# Altium project Chicker.PrjPcb
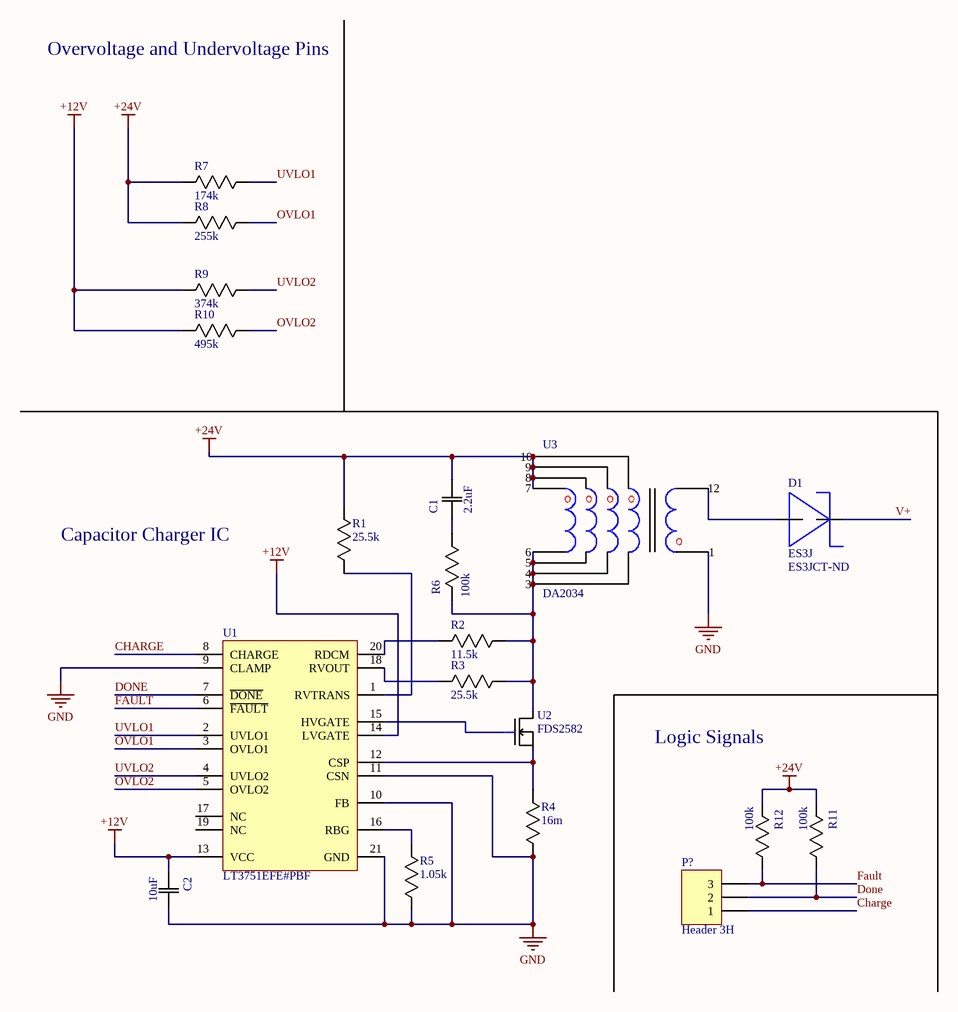
[diagram p0: Chicker.SchDoc]
1 sheet, 19 parts. Net scope: global (net labels, ports and power ports of the same name join across sheets).
Board file: Chicker.PcbDoc

## Sheet Chicker.SchDoc
size A4

### Parts
C1  2.2uF  [0805]
C2  10uF  [0805]
D1  ES3J  Supplier Part Number 1: ES3JCT-ND  [D0214-AB]
P?  Header 3H  [HDR1X3H]
R1  25.5k  [0805]
R2  11.5k  [0805]
R3  25.5k  [0805]
R4  16m  [0805]
R5  1.05k  [0805]
R6  100k  [0805]
R7  174k  [0805]
R8  255k  [0805]
R9  374k  [0805]
R10  495k  [0805]
R11  100k  [0805]
R12  100k  [0805]
U1  LT3751EFE#PBF  [LT-FE-20-EPV-CB_L]
U2  FDS2582  [8-SOIC MOSFET]
U3  DA2034  [DA2034]

### Nets
+12V: C2.1(C1) R9.2(R2) R10.2(R2) U1.13(VCC) U1.14(LVGATE)
+24V: C1.2(C2) R1.1(R1) R7.2(R2) R8.2(R2) R11.2(R2) R12.2(R2) U3.7 U3.8 U3.9 U3.10
GND: C2.2(C2) R4.2(R2) R5.2(R2) U1.9(CLAMP) U1.10(FB) U1.11(CSN) U1.21(GND) U3.1
CHARGE: P?.1 U1.8(CHARGE)
DONE: P?.2 R11.1(R1) U1.7(~{DONE})
FAULT: P?.3 R12.1(R1) U1.6(~{FAULT})
OVLO1: R8.1(R1) U1.3(OVLO1)
OVLO2: R10.1(R1) U1.5(OVLO2)
UVLO1: R7.1(R1) U1.2(UVLO1)
UVLO2: R9.1(R1) U1.4(UVLO2)
V+: D1.OUT
NetC1_1: C1.1(C1) R6.1(R1)
NetD1_IN: D1.IN U3.12
NetR1_2: R1.2(R2) U1.1(RVTRANS)
NetR2_1: R2.1(R1) R3.1(R1) R6.2(R2) U2.D U3.3 U3.4 U3.5 U3.6
NetR2_2: R2.2(R2) U1.20(RDCM)
NetR3_2: R3.2(R2) U1.18(RVOUT)
NetR4_1: R4.1(R1) U1.12(CSP) U2.S
NetR5_1: R5.1(R1) U1.16(RBG)
NetU1_15: U1.15(HVGATE) U2.G

Not connected (* = marked no-connect by the designer): U1 17(NC) 19(NC)

### Notes on the sheet
- Overvoltage and Undervoltage Pins
- Capacitor Charger IC
- Logic Signals

### Library data of the parts
C1 = CAP 2.2uF 0805: CAP CER 1UF 50V X7R 0805; MP: C0805C225K4RACTU; MF: KEMET; Tolerance: 10%; Rating: 16V; Package: 0805; Price: 0,461 CAD; Value: 2.2uF; Digikey: 399-3523-1-ND; Digikey Link: https://www.digikey.ca/products/en?keywords=399-3523-1-ND
C2 = CAP 10uF 0805: CAP CER 10UF 10V X5R 0805; MP: C0805C106K8PACTU; MF: KEMET; Tolerance: 10%; Package: 0805; Price: 0.168 CAD; Value: 10uF; Digikey: 399-4925-1-ND; Digikey Link: https://www.digikey.ca/product-detail/en/kemet/C0805C106K8PACTU/399-4925-1-ND/1090920; Rating: 10V
D1 = ES3J: Diode Switching 600V 3A 2-Pin DO-214AB T/R; Manufacturer: ON Semiconductor / Fairchild; Element Configuration: Single; Power Dissipation: 1.66W; Reverse Recovery Time: 35ns; Peak Non-Repetitive Surge Current: 100A; Polarity: Standard; Capacitance: 45pF; Forward Voltage: 1.7V; Peak Reverse Current: 10uA; Supplier 1: Digi-Key; Manufacturer Part Number: ES3J; RoHS: Yes; Category: Zener Diodes; Stock 1: 20740; Pricing 1: 1=0.47000, 10=0.37800, 25=0.34600, 100=0.21740, 250=0.21492, 500=0.20126, 1000=0.13685 (USD); Mount: Surface Mount; Case/Package: SMC; Number of Pins: 2; Contact Plating: Tin,Matte; Min Operating Temperature: -50°C; Max Operating Temperature: 150°C; Reverse Voltage: 600V; Max Reverse Voltage (DC): 600V; Average Rectified Current: 3A; Max Repetitive Reverse Voltage (Vrrm): 600V; Max Forward Surge Current (Ifsm): 100A; Current: 3A; Voltage: 600V; Voltage Rating (DC): 600V; Current Rating: 3A; Output Current: 3A; Max Surge Current: 100A; Packaging: Tape and Reel; Package Quantity: 3000; Recovery Time: 35ns; Forward Current: 3A; Length: 7.11mm; Height: 2.616mm; Width: 6.223mm; Radiation Hardening: No; REACH SVHC: No SVHC; Lead Free: Lead Free; ComponentLink1URL: https://datasheet.ciiva.com/4452/es3j-187547-4452440.pdf?src-supplier=Mouser; ComponentLink1Description: https://datasheet.ciiva.com/4452/es3j-187547-4452440.pdf?src-supplier=Mouser; ComponentLink2URL: https://datasheet.ciiva.com/30479/0900766b810e1d0b-30479500.pdf?src-supplier=RSComponents; ComponentLink2Description: https://datasheet.ciiva.com/30479/0900766b810e1d0b-30479500.pdf?src-supplier=RSComponents; ComponentLink3URL: https://datasheet.ciiva.com/22651/1856389-22651960.pdf?src-supplier=Element14; ComponentLink3Description: https://datasheet.ciiva.com/22651/1856389-22651960.pdf?src-supplier=Element14; ComponentLink4URL: https://datasheet.ciiva.com/26230/es3j-26230952.pdf?src-supplier=Avnet+Europe; ComponentLink4Description: https://datasheet.ciiva.com/26230/es3j-26230952.pdf?src-supplier=Avnet+Europe; ComponentLink5URL: https://datasheet.ciiva.com/911/es3a-911003.pdf?src-supplier=Digi-Key; ComponentLink5Description: https://datasheet.ciiva.com/911/es3a-911003.pdf?src-supplier=Digi-Key; ComponentLink6URL: https://datasheet.ciiva.com/911/es3a-911004.pdf?src-supplier=Digi-Key; ComponentLink6Description: https://datasheet.ciiva.com/911/es3a-911004.pdf?src-supplier=Digi-Key; ComponentLink7URL: https://datasheet.ciiva.com/23683/1856389-23683564.pdf?src-supplier=Newark; ComponentLink7Description: https://datasheet.ciiva.com/23683/1856389-23683564.pdf?src-supplier=Newark; ComponentLink8URL: https://datasheet.ciiva.com/17194/es3j-17194703.pdf?src-supplier=Future+Electronics; ComponentLink8Description: https://datasheet.ciiva.com/17194/es3j-17194703.pdf?src-supplier=Future+Electronics; ComponentLink9URL: https://datasheet.ciiva.com/7965/1856389-7965165.pdf?src-supplier=Element14; ComponentLink9Description: https://datasheet.ciiva.com/7965/1856389-7965165.pdf?src-supplier=Element14; ComponentLink10URL: https://datasheet.ciiva.com/8300/es3j-8300861.pdf?src-supplier=Avnet; ComponentLink10Description: https://datasheet.ciiva.com/8300/es3j-8300861.pdf?src-supplier=Avnet
P? = Header 3H: Header, 3-Pin, Right Angle; LatestRevisionDate: 17-Jul-2002; LatestRevisionNote: Re-released for DXP Platform.; Publisher: Altium Limited
R1 R3 = RES 25.5k 0805: 0805 Resistor, 6A, 0.125W, 25ppm, 0.1%, 25K5; Manufacturer: Panasonic; Manufacturer Part Number: ERA-6AEB2552V; Temperature Coefficient: 25ppm/°C; Max Power Dissipation: 125mW; Resistance: 25.5kR; Voltage Rating: 100V; Supplier 1: Digi-Key; RoHS: Yes; Category: Chip SMD Resistors; Stock 1: 5872; Pricing 1: 1=0.36000, 10=0.30200, 100=0.11820, 1000=0.04948, 2500=0.04536 (USD); Mount: Surface Mount; Case/Package: 0805; Number of Pins: 2; Case Code (Imperial): 0805; Case Code (Metric): 2012; Contact Plating: Tin; Min Operating Temperature: -55°C; Max Operating Temperature: 155°C; Number of Terminations: 2; Features: Automotive AEC-Q200; Tolerance: 0.1%; Composition: Metal Film,Thin Film; Packaging: Tape and Reel; Military Standard: Not; Termination: Solder; Power Rating: 125mW; Package Quantity: 1; Voltage Rating (DC): 100V; Length: 2mm; Height: 0.5mm; Width: 1.25mm; Depth: 1.25mm; Radiation Hardening: No; Lead Free: Lead Free; ComponentLink1URL: https://datasheet.ciiva.com/11810/0900766b80eb1d8c-11810651.pdf?src-supplier=RSComponents; ComponentLink1Description: https://datasheet.ciiva.com/11810/0900766b80eb1d8c-11810651.pdf?src-supplier=RSComponents; ComponentLink2URL: https://datasheet.ciiva.com/26335/459526-da-01-en-widerstand-0805-era-26335831.pdf?src-supplier=Conrad; ComponentLink2Description: https://datasheet.ciiva.com/26335/459526-da-01-en-widerstand-0805-era-26335831.pdf?src-supplier=Conrad; ComponentLink3URL: https://datasheet.ciiva.com/7870/485442-7870651.pdf?src-supplier=Element14; ComponentLink3Description: https://datasheet.ciiva.com/7870/485442-7870651.pdf?src-supplier=Element14; ComponentLink4URL: https://datasheet.ciiva.com/5987/485442-5987308.pdf?src-supplier=Farnell; ComponentLink4Description: https://datasheet.ciiva.com/5987/485442-5987308.pdf?src-supplier=Farnell; ComponentLink5URL: https://datasheet.ciiva.com/7870/485442-7870652.pdf?src-supplier=Element14; ComponentLink5Description: https://datasheet.ciiva.com/7870/485442-7870652.pdf?src-supplier=Element14; ComponentLink6URL: https://datasheet.ciiva.com/30151/54aoa0000ce26-30151583.pdf?src-supplier=Onlinecomponents.com; ComponentLink6Description: https://datasheet.ciiva.com/30151/54aoa0000ce26-30151583.pdf?src-supplier=Onlinecomponents.com; ComponentLink7URL: https://datasheet.ciiva.com/9191/aoa0000ce26-9191422.pdf?src-supplier=Avnet; ComponentLink7Description: https://datasheet.ciiva.com/9191/aoa0000ce26-9191422.pdf?src-supplier=Avnet; Supplier Part Number 1: P25.5KDACT-ND
R2 = RES 11.5k 0805: Res Thin Film 0805 11.5K Ohm 0.1% 1/8W 25ppm/C Molded SMD SMD Punched Carrier T/R; Manufacturer: Panasonic; Manufacturer Part Number: ERA-6AEB1152V; Power Rating: 125mW; Resistance: 11.5kR; Voltage Rating: 100V; Temperature Coefficient: 25ppm/°C; Supplier 1: Digi-Key; RoHS: Yes; Category: Chip SMD Resistors; Stock 1: 10661; Pricing 1: 1=0.34000, 10=0.28800, 100=0.11260, 1000=0.04712, 2500=0.04320 (USD); Mount: Surface Mount; Case/Package: 0805; Number of Pins: 2; Case Code (Metric): 2012; Case Code (Imperial): 0805; Contact Plating: Tin; Min Operating Temperature: -55°C; Max Operating Temperature: 155°C; Tolerance: 0.1%; Packaging: Tape and Reel; Max Power Dissipation: 125mW; Composition: Thin Film,Metal Film; Number of Terminations: 2; Voltage Rating (DC): 100V; Termination: Solder; Military Standard: Not; Package Quantity: 1; Features: Automotive AEC-Q200; Length: 2mm; Height: 0.5mm; Width: 1.25mm; Depth: 1.25mm; Radiation Hardening: No; Lead Free: Lead Free; ComponentLink1URL: https://datasheet.ciiva.com/11810/0900766b80eb1d8c-11810868.pdf?src-supplier=RSComponents; ComponentLink1Description: https://datasheet.ciiva.com/11810/0900766b80eb1d8c-11810868.pdf?src-supplier=RSComponents; ComponentLink2URL: https://datasheet.ciiva.com/41450/001181306-da-01-en-widerstand-era-0805-11k5-0-1-5000st-41450464.pdf?src-supplier=Conrad; ComponentLink2Description: https://datasheet.ciiva.com/41450/001181306-da-01-en-widerstand-era-0805-11k5-0-1-5000st-41450464.pdf?src-supplier=Conrad; ComponentLink3URL: https://datasheet.ciiva.com/5987/485442-5987301.pdf?src-supplier=Farnell; ComponentLink3Description: https://datasheet.ciiva.com/5987/485442-5987301.pdf?src-supplier=Farnell; ComponentLink4URL: https://datasheet.ciiva.com/7829/485442-7829142.pdf?src-supplier=Element14; ComponentLink4Description: https://datasheet.ciiva.com/7829/485442-7829142.pdf?src-supplier=Element14; ComponentLink5URL: https://datasheet.ciiva.com/17211/aoa0000ce26-17211855.pdf?src-supplier=Avnet+Europe; ComponentLink5Description: https://datasheet.ciiva.com/17211/aoa0000ce26-17211855.pdf?src-supplier=Avnet+Europe; ComponentLink6URL: https://datasheet.ciiva.com/7829/485442-7829143.pdf?src-supplier=Element14; ComponentLink6Description: https://datasheet.ciiva.com/7829/485442-7829143.pdf?src-supplier=Element14; ComponentLink7URL: https://datasheet.ciiva.com/9193/aoa0000ce26-9193735.pdf?src-supplier=Avnet; ComponentLink7Description: https://datasheet.ciiva.com/9193/aoa0000ce26-9193735.pdf?src-supplier=Avnet; ComponentLink8URL: https://datasheet.ciiva.com/24024/aoa0000ce26-197354-24024328.pdf?src-supplier=Mouser; ComponentLink8Description: https://datasheet.ciiva.com/24024/aoa0000ce26-197354-24024328.pdf?src-supplier=Mouser; Supplier Part Number 1: P11.5KDACT-ND
R4 = RES 16mOhm 0805: Res Thick Film 0805 0.016 Ohm 1% 0.5W(1/2W) ±200ppm/C Molded SMD Automotive Punched T/R; Manufacturer: Panasonic; Manufacturer Part Number: ERJ-6BWFR016V; Resistance: 16mR; Power Rating: 500mW; Temperature Coefficient: 200ppm/°C; Supplier 1: Digi-Key; RoHS: Yes; Category: Chip SMD Resistors; Stock 1: 4585; Pricing 1: 1=0.65000, 10=0.53800, 100=0.36140, 1000=0.21148, 2500=0.20917 (USD); Mount: Surface Mount; Case/Package: 0805; Number of Pins: 2; Contact Plating: Tin; Case Code (Metric): 2012; Case Code (Imperial): 0805; Min Operating Temperature: -55°C; Max Operating Temperature: 155°C; Tolerance: 1%; Packaging: Tape and Reel; Package Quantity: 1; Features: Automotive AEC-Q200; Max Power Dissipation: 500mW; Composition: Thick Film; Number of Terminations: 2; Termination: SMD/SMT; Military Standard: Not; Length: 2mm; Height: 0.028inch; Width: 0.049inch; Depth: 1.25mm; Radiation Hardening: No; Lead Free: Lead Free; ComponentLink1URL: https://datasheet.ciiva.com/11808/0900766b8126441d-11808690.pdf?src-supplier=RSComponents; ComponentLink1Description: https://datasheet.ciiva.com/11808/0900766b8126441d-11808690.pdf?src-supplier=RSComponents; ComponentLink2URL: https://datasheet.ciiva.com/2452/aoa0000ce3-2452594.pdf?src-supplier=Digi-Key; ComponentLink2Description: https://datasheet.ciiva.com/2452/aoa0000ce3-2452594.pdf?src-supplier=Digi-Key; ComponentLink3URL: https://datasheet.ciiva.com/2452/aoa0000ce3-2452592.pdf?src-supplier=Digi-Key; ComponentLink3Description: https://datasheet.ciiva.com/2452/aoa0000ce3-2452592.pdf?src-supplier=Digi-Key; ComponentLink4URL: https://datasheet.ciiva.com/2452/aoa0000ce3-2452593.pdf?src-supplier=Digi-Key; ComponentLink4Description: https://datasheet.ciiva.com/2452/aoa0000ce3-2452593.pdf?src-supplier=Digi-Key; ComponentLink5URL: https://datasheet.ciiva.com/9192/aoa0000ce3-9192761.pdf?src-supplier=Avnet; ComponentLink5Description: https://datasheet.ciiva.com/9192/aoa0000ce3-9192761.pdf?src-supplier=Avnet; ComponentLink6URL: https://datasheet.ciiva.com/17211/aoa0000ce3-17211370.pdf?src-supplier=Avnet+Europe; ComponentLink6Description: https://datasheet.ciiva.com/17211/aoa0000ce3-17211370.pdf?src-supplier=Avnet+Europe; Supplier Part Number 1: P.016AQCT-ND
R5 = RES 1.05k 0805: Res Thin Film 0805 10.5K Ohm 0.1% 0.125W(1/8W) ±25ppm/C Molded SMD Automotive Punched T/R; Manufacturer: Panasonic; Manufacturer Part Number: ERA-6AEB1052V; Resistance: 10.5kR; Power Rating: 125mW; Voltage Rating: 100V; Temperature Coefficient: 25ppm/°C; Supplier 1: Digi-Key; RoHS: Yes; Category: Chip SMD Resistors; Stock 1: 21208; Pricing 1: 1=0.34000, 10=0.28800, 100=0.11260, 1000=0.04712, 2500=0.04320 (USD); Mount: Surface Mount; Case/Package: 0805; Number of Pins: 2; Case Code (Metric): 2012; Case Code (Imperial): 0805; Contact Plating: Tin; Min Operating Temperature: -55°C; Max Operating Temperature: 155°C; Tolerance: 0.1%; Packaging: Tape and Reel; Composition: Thin Film,Metal Film; Package Quantity: 1; Max Power Dissipation: 125mW; Number of Terminations: 2; Termination: Solder; Voltage Rating (DC): 100V; Features: Automotive AEC-Q200; Military Standard: Not; Length: 2mm; Height: 0.5mm; Width: 1.25mm; Depth: 1.25mm; Radiation Hardening: No; Lead Free: Lead Free; REACH SVHC: No SVHC; ComponentLink1URL: https://datasheet.ciiva.com/11810/0900766b80eb1d8c-11810443.pdf?src-supplier=RSComponents; ComponentLink1Description: https://datasheet.ciiva.com/11810/0900766b80eb1d8c-11810443.pdf?src-supplier=RSComponents; ComponentLink2URL: https://datasheet.ciiva.com/41450/001181303-da-01-en-widerstand-era-0805-10k5-0-1-5000st-41450463.pdf?src-supplier=Conrad; ComponentLink2Description: https://datasheet.ciiva.com/41450/001181303-da-01-en-widerstand-era-0805-10k5-0-1-5000st-41450463.pdf?src-supplier=Conrad; ComponentLink3URL: https://datasheet.ciiva.com/5987/485442-5987261.pdf?src-supplier=Farnell; ComponentLink3Description: https://datasheet.ciiva.com/5987/485442-5987261.pdf?src-supplier=Farnell; ComponentLink4URL: https://datasheet.ciiva.com/17211/aoa0000ce26-17211965.pdf?src-supplier=Avnet+Europe; ComponentLink4Description: https://datasheet.ciiva.com/17211/aoa0000ce26-17211965.pdf?src-supplier=Avnet+Europe; ComponentLink5URL: https://datasheet.ciiva.com/9194/aoa0000ce26-9194028.pdf?src-supplier=Avnet; ComponentLink5Description: https://datasheet.ciiva.com/9194/aoa0000ce26-9194028.pdf?src-supplier=Avnet; ComponentLink6URL: https://datasheet.ciiva.com/5987/485442-5987263.pdf?src-supplier=Farnell; ComponentLink6Description: https://datasheet.ciiva.com/5987/485442-5987263.pdf?src-supplier=Farnell; Supplier Part Number 1: P10.5KDACT-ND
R6 R11 R12 = RES 100k 0805: RES SMD 100K OHM 1% 1/8W 0805; MP: RC0805FR-07100KL; MF: Yageo; Rating: 0.125W; Digikey: 311-100KCRCT-ND; Price: 0.058 CAD; Package: 0805; Value: 100k; Digikey Link: https://www.digikey.ca/products/en?keywords=311-100KCRCT-ND; Tolerance: 1%
R7 = RES 174k 0805: RES SMD 174K OHM 1% 1/8W 0805; Manufacturer: Yageo; Manufacturer Part Number: RC0805FR-07174KL; Max Power Dissipation: 125mW; Resistance: 174kR; Temperature Coefficient: 100ppm/°C; Voltage Rating: 150V; Supplier 1: Digi-Key; RoHS: Yes; Category: Chip SMD Resistors; Stock 1: 27863; Pricing 1: 1=0.10000, 10=0.04000, 100=0.01630, 1000=0.00731, 2500=0.00635 (USD); Case/Package: 0805; Case Code (Metric): 2012; Case Code (Imperial): 0805; Contact Plating: Tin,Matte; Min Operating Temperature: -55°C; Max Operating Temperature: 155°C; Package Quantity: 1; Power Rating: 125mW; Tolerance: 1%; Packaging: Tape and Reel; Features: Moisture Resistant; Composition: Thick Film; Number of Terminations: 2; Termination: SMD/SMT; Military Standard: Not; Voltage Rating (DC): 150V; Length: 2mm; Height: 0.024inch; Width: 0.049inch; Depth: 1.25mm; Radiation Hardening: No; Lead Free: Lead Free; ComponentLink1URL: https://datasheet.ciiva.com/2509/pyu-r-int-thick-7-2509472.pdf?src-supplier=Digi-Key; ComponentLink1Description: https://datasheet.ciiva.com/2509/pyu-r-int-thick-7-2509472.pdf?src-supplier=Digi-Key; ComponentLink2URL: https://datasheet.ciiva.com/2509/pyu-r-int-thick-7-2509471.pdf?src-supplier=Digi-Key; ComponentLink2Description: https://datasheet.ciiva.com/2509/pyu-r-int-thick-7-2509471.pdf?src-supplier=Digi-Key; ComponentLink3URL: https://datasheet.ciiva.com/2509/pyu-r-int-thick-7-2509473.pdf?src-supplier=Digi-Key; ComponentLink3Description: https://datasheet.ciiva.com/2509/pyu-r-int-thick-7-2509473.pdf?src-supplier=Digi-Key; Supplier Part Number 1: 311-174KCRCT-ND
R8 = RES 255k 0805: 0805 Resistor, 6A, 0.125W, 25ppm, 0.1%, 255K; Manufacturer: Panasonic; Manufacturer Part Number: ERA-6AEB2553V; Max Power Dissipation: 125mW; Resistance: 255kR; Temperature Coefficient: 25ppm/°C; Voltage Rating (DC): 100V; Voltage Rating: 200V; Supplier 1: Digi-Key; RoHS: Yes; Category: Chip SMD Resistors; Stock 1: 7869; Pricing 1: 1=0.36000, 10=0.30200, 100=0.11820, 1000=0.04948, 2500=0.04536 (USD); Mount: Surface Mount; Case/Package: 0805; Number of Pins: 2; Weight: 0.000194oz; Case Code (Imperial): 0805; Case Code (Metric): 2012; Contact Plating: Tin; Min Operating Temperature: -55°C; Max Operating Temperature: 155°C; Features: Automotive AEC-Q200; Tolerance: 0.1%; Number of Terminations: 2; Packaging: Tape and Reel; Composition: Metal Film,Thin Film; Power Rating: 125mW; Termination: SMD/SMT; Military Standard: Not; Package Quantity: 1; Length: 2mm; Height: 0.5mm; Width: 1.25mm; Depth: 1.25mm; Radiation Hardening: No; Lead Free: Lead Free; REACH SVHC: No SVHC; ComponentLink1URL: https://datasheet.ciiva.com/11810/0900766b80eb1d8c-11810615.pdf?src-supplier=RSComponents; ComponentLink1Description: https://datasheet.ciiva.com/11810/0900766b80eb1d8c-11810615.pdf?src-supplier=RSComponents; ComponentLink2URL: https://datasheet.ciiva.com/41450/001181380-da-01-en-widerstand-era-0805-255k-0-1-5000st-41450539.pdf?src-supplier=Conrad; ComponentLink2Description: https://datasheet.ciiva.com/41450/001181380-da-01-en-widerstand-era-0805-255k-0-1-5000st-41450539.pdf?src-supplier=Conrad; ComponentLink3URL: https://datasheet.ciiva.com/5981/485442-5981317.pdf?src-supplier=Farnell; ComponentLink3Description: https://datasheet.ciiva.com/5981/485442-5981317.pdf?src-supplier=Farnell; ComponentLink4URL: https://datasheet.ciiva.com/5981/485442-5981318.pdf?src-supplier=Farnell; ComponentLink4Description: https://datasheet.ciiva.com/5981/485442-5981318.pdf?src-supplier=Farnell; ComponentLink5URL: https://datasheet.ciiva.com/5981/485442-5981319.pdf?src-supplier=Farnell; ComponentLink5Description: https://datasheet.ciiva.com/5981/485442-5981319.pdf?src-supplier=Farnell; ComponentLink6URL: https://datasheet.ciiva.com/5981/485442-5981320.pdf?src-supplier=Farnell; ComponentLink6Description: https://datasheet.ciiva.com/5981/485442-5981320.pdf?src-supplier=Farnell; ComponentLink7URL: https://datasheet.ciiva.com/17206/aoa0000ce26-17206655.pdf?src-supplier=Avnet+Europe; ComponentLink7Description: https://datasheet.ciiva.com/17206/aoa0000ce26-17206655.pdf?src-supplier=Avnet+Europe; Supplier Part Number 1: P255KDACT-ND
R9 = RES 374k 0805: 0805 Resistor, 6A, 0.125W, 25ppm, 0.1%, 374K; Manufacturer: Panasonic; Manufacturer Part Number: ERA-6AEB3743V; Resistance: 374kR; Temperature Coefficient: 25ppm/°C; Max Power Dissipation: 125mW; Voltage Rating: 100V; Supplier 1: Digi-Key; RoHS: Yes; Category: Chip SMD Resistors; Stock 1: 10062; Pricing 1: 1=0.34000, 10=0.28800, 100=0.11260, 1000=0.04712, 2500=0.04320 (USD); Mount: Surface Mount; Case/Package: 0805; Number of Pins: 2; Contact Plating: Tin; Case Code (Metric): 2012; Case Code (Imperial): 0805; Min Operating Temperature: -55°C; Max Operating Temperature: 155°C; Tolerance: 0.1%; Packaging: Tape and Reel; Package Quantity: 5000; Features: Automotive AEC-Q200; Number of Terminations: 2; Composition: Thin Film,Metal Film; Power Rating: 125mW; Termination: Solder; Voltage Rating (DC): 100V; Length: 2mm; Height: 0.5mm; Width: 1.25mm; Depth: 1.25mm; Radiation Hardening: No; Lead Free: Lead Free; ComponentLink1URL: https://datasheet.ciiva.com/11810/0900766b80eb1d8c-11810612.pdf?src-supplier=RSComponents; ComponentLink1Description: https://datasheet.ciiva.com/11810/0900766b80eb1d8c-11810612.pdf?src-supplier=RSComponents; ComponentLink2URL: https://datasheet.ciiva.com/41450/001181392-da-01-en-widerstand-era-0805-374k-0-1-5000st-41450550.pdf?src-supplier=Conrad; ComponentLink2Description: https://datasheet.ciiva.com/41450/001181392-da-01-en-widerstand-era-0805-374k-0-1-5000st-41450550.pdf?src-supplier=Conrad; ComponentLink3URL: https://datasheet.ciiva.com/17206/aoa0000ce26-17206008.pdf?src-supplier=Avnet+Europe; ComponentLink3Description: https://datasheet.ciiva.com/17206/aoa0000ce26-17206008.pdf?src-supplier=Avnet+Europe; ComponentLink4URL: https://datasheet.ciiva.com/6001/485442-6001717.pdf?src-supplier=Farnell; ComponentLink4Description: https://datasheet.ciiva.com/6001/485442-6001717.pdf?src-supplier=Farnell; ComponentLink5URL: https://datasheet.ciiva.com/9182/aoa0000ce26-9182549.pdf?src-supplier=Avnet; ComponentLink5Description: https://datasheet.ciiva.com/9182/aoa0000ce26-9182549.pdf?src-supplier=Avnet; ComponentLink6URL: https://datasheet.ciiva.com/6001/485442-6001718.pdf?src-supplier=Farnell; ComponentLink6Description: https://datasheet.ciiva.com/6001/485442-6001718.pdf?src-supplier=Farnell; ComponentLink7URL: https://datasheet.ciiva.com/7753/485442-7753884.pdf?src-supplier=Element14; ComponentLink7Description: https://datasheet.ciiva.com/7753/485442-7753884.pdf?src-supplier=Element14; ComponentLink8URL: https://datasheet.ciiva.com/7753/485442-7753885.pdf?src-supplier=Element14; ComponentLink8Description: https://datasheet.ciiva.com/7753/485442-7753885.pdf?src-supplier=Element14; Supplier Part Number 1: P374KDACT-ND
R10 = RES 495k 0805: RES SMD 499K OHM 1% 1/8W 0805; Manufacturer: Yageo; Manufacturer Part Number: RC0805FR-07499KL; Temperature Coefficient: 100ppm/°C; Voltage Rating (DC): 150V; Resistance: 499kR; Power Rating: 125mW; Supplier 1: Digi-Key; RoHS: Yes; Category: Chip SMD Resistors; Stock 1: 2275; Pricing 1: 1=0.10000, 10=0.04000, 100=0.01630, 1000=0.00731, 2500=0.00635 (USD); Case/Package: 0805; Case Code (Metric): 2012; Case Code (Imperial): 0805; Contact Plating: Tin,Lead,Matte; Min Operating Temperature: -55°C; Max Operating Temperature: 155°C; Termination: SMD/SMT; Composition: Thick Film; Military Standard: Not; Tolerance: 1%; Voltage Rating: 150V; Packaging: Tape and Reel; Length: 2mm; Depth: 1.25mm; Radiation Hardening: No; Lead Free: Lead Free; ComponentLink1URL: https://datasheet.ciiva.com/15189/getdatasheetpartid-326570-15189975.pdf?src-supplier=Verical; ComponentLink1Description: https://datasheet.ciiva.com/15189/getdatasheetpartid-326570-15189975.pdf?src-supplier=Verical; Supplier Part Number 1: 311-499KCRCT-ND
U1 = LT3751EFE#PBF: Controller to 20-Pin TSSOP EP; Manufacturer: Analog Devices / Linear Technology; Output Voltage: 500V; Output Current: 150mA; Max Input Voltage: 24V; Min Supply Voltage: 4.75V; Number of Outputs: 1; Operating Supply Current: 5.5mA; Supplier 1: Digi-Key; Manufacturer Part Number: LT3751EFE#PBF; RoHS: Yes; Category: Voltage Regulators - Switching; Stock 1: 1231; Pricing 1: 1=9.26000, 25=6.14640, 100=5.08200, 250=4.82792, 500=4.71900 (USD); Case/Package: TSSOP; Number of Pins: 20; Min Operating Temperature: -40°C; Max Operating Temperature: 125°C; Package Quantity: 74; Packaging: Rail/Tube; Termination: SMD/SMT; Max Supply Voltage: 24V; Radiation Hardening: No; REACH SVHC: No SVHC; ComponentLink1URL: https://datasheet.ciiva.com/15104/getdatasheetpartid-472813-15104438.pdf?src-supplier=Verical; ComponentLink1Description: https://datasheet.ciiva.com/15104/getdatasheetpartid-472813-15104438.pdf?src-supplier=Verical; ComponentLink2URL: https://datasheet.ciiva.com/31429/1692507-31429494.pdf?src-supplier=Farnell; ComponentLink2Description: https://datasheet.ciiva.com/31429/1692507-31429494.pdf?src-supplier=Farnell; ComponentLink3URL: https://datasheet.ciiva.com/1964/27024-1964843.pdf?src-supplier=Digi-Key; ComponentLink3Description: https://datasheet.ciiva.com/1964/27024-1964843.pdf?src-supplier=Digi-Key
U2 = FDS2582: N-Channel 150V 4.1A (Ta) 2.5W (Ta) Surface Mount 8-SOIC; MF: ON Semiconductor; MP: FDS2582; Digikey: FDS2582CT-ND; Price: 0.98 CAD; Rating: 150V; Digikey Link: https://www.digikey.com/product-detail/en/on-semiconductor/FDS2582/FDS2582CT-ND/3025307; Package: 8-SOIC
U3 = DA2034: Audio Transformers / Signal Transformers DA2032 Cap Chrgr For Linear LT3750/51